# Altium schematic sheet Filter6.SchDoc
size 420 x 297 mm; SheetNumber: 11; SheetTotal: 13
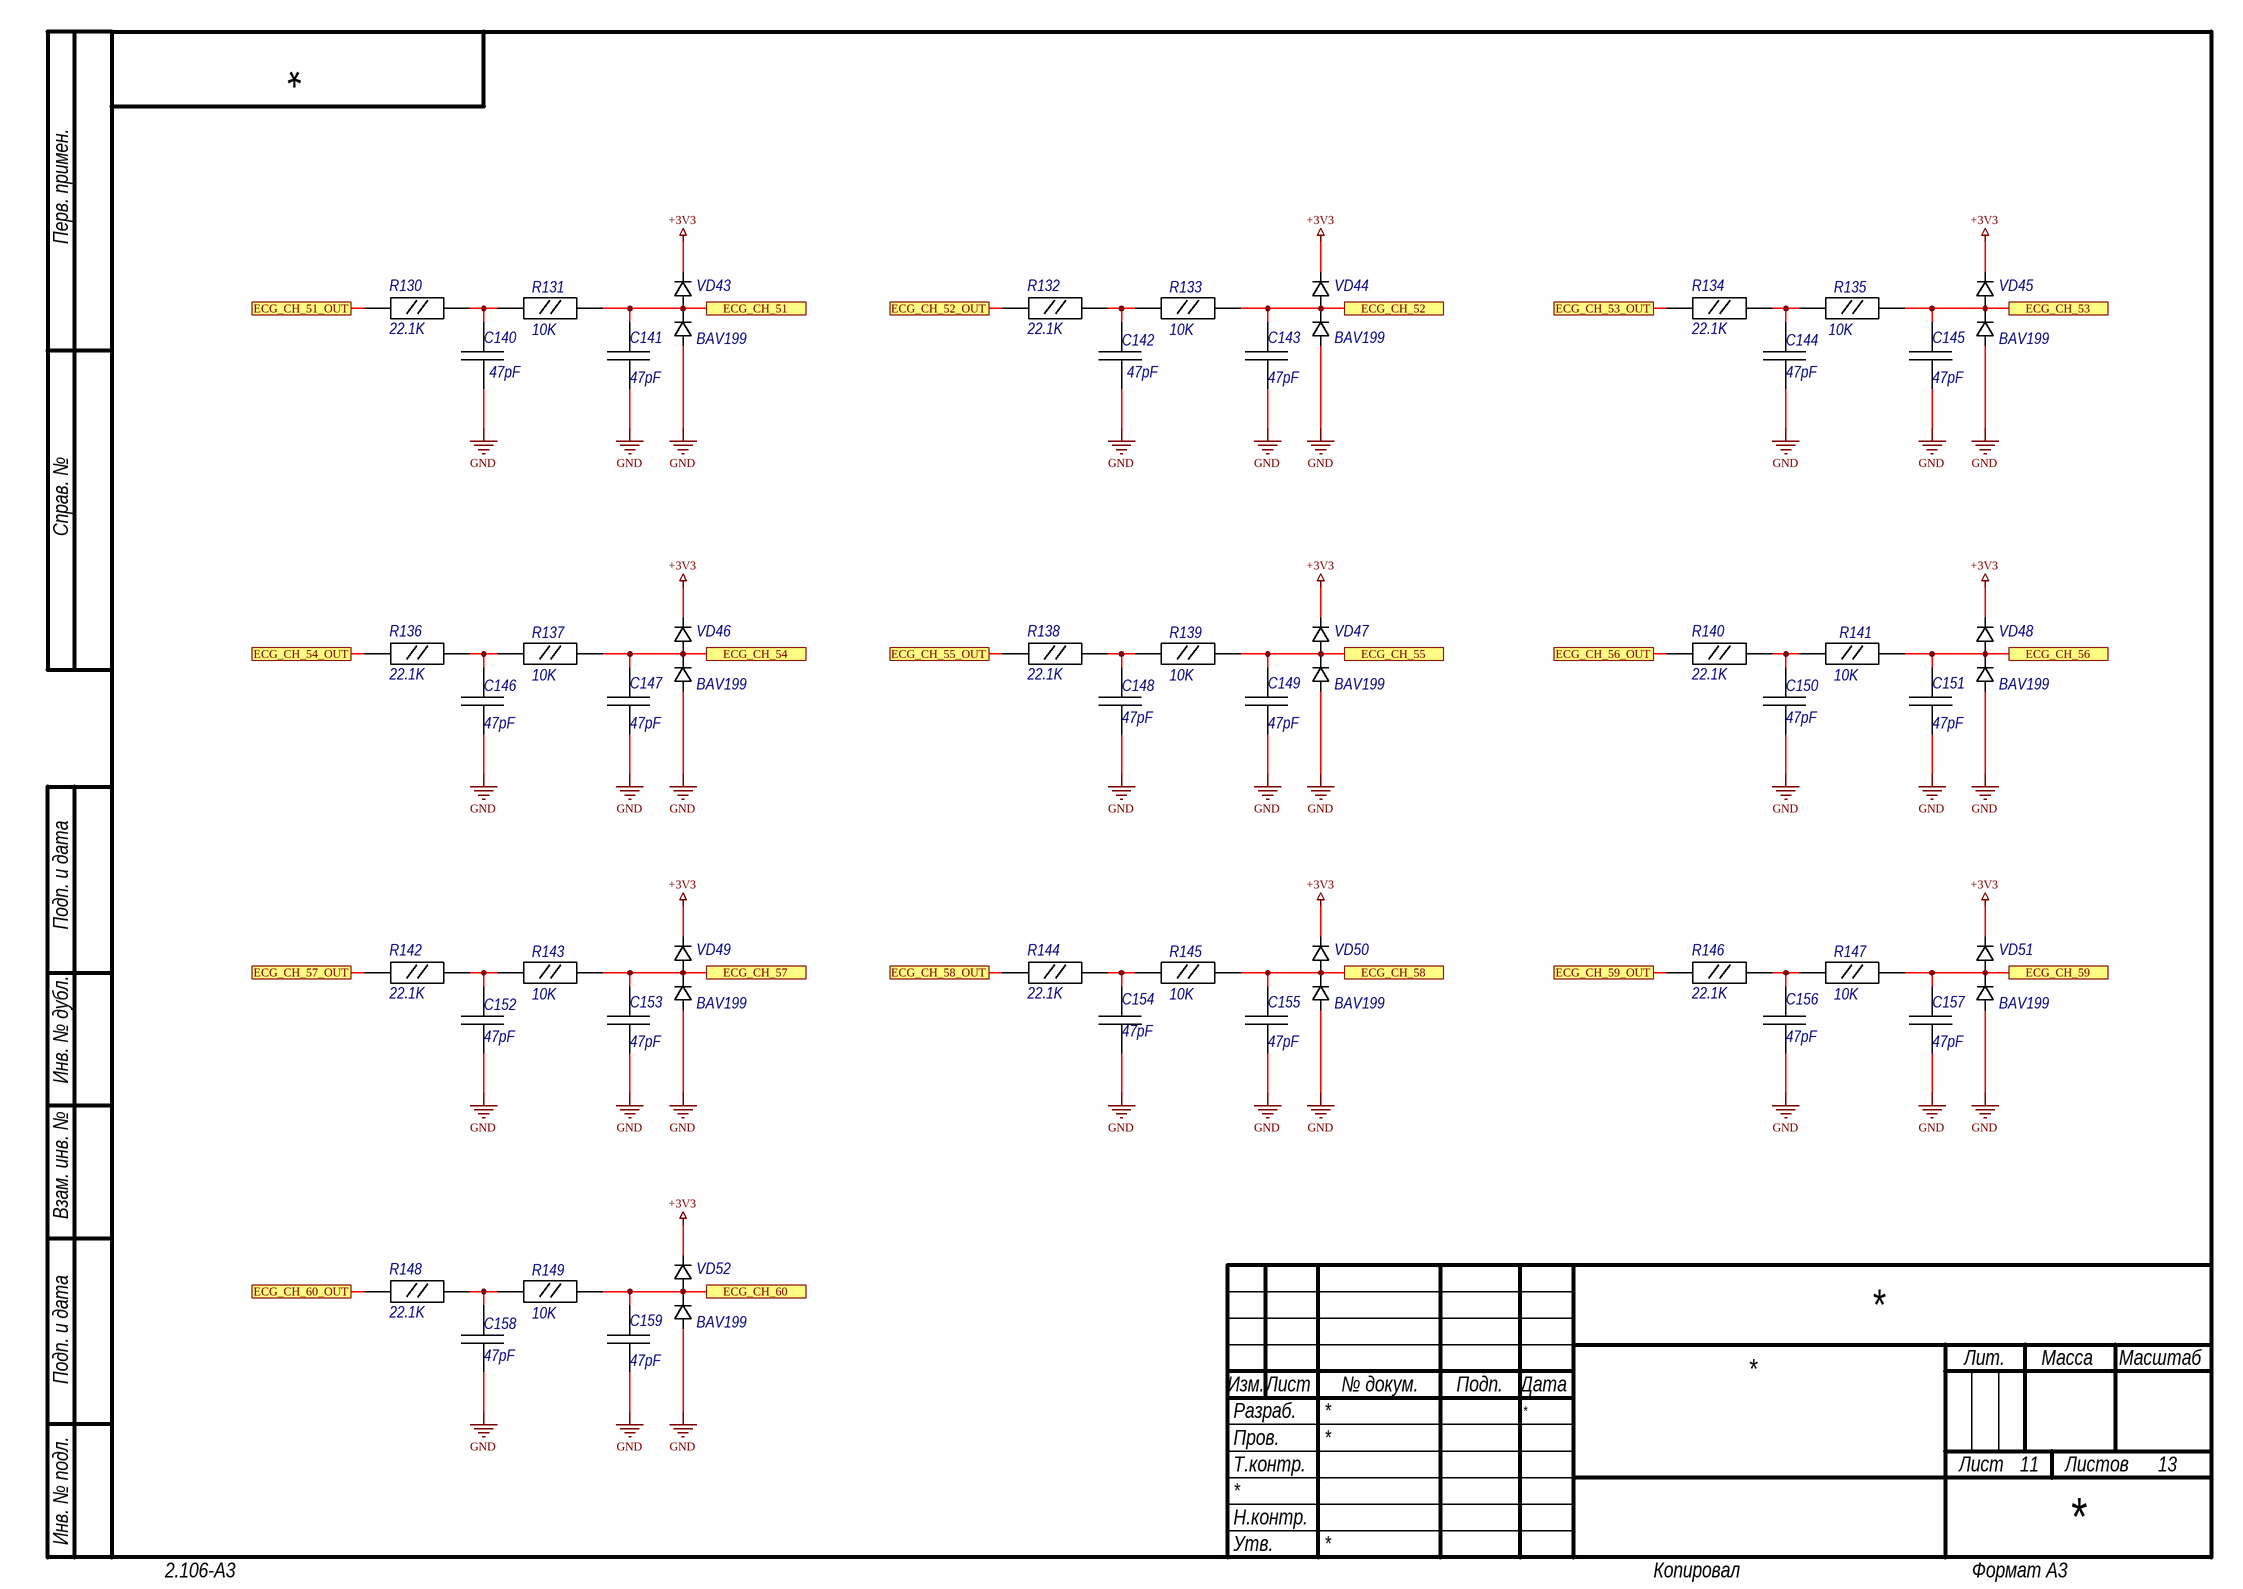
[diagram p0: Filter6.SchDoc]

## Parts
C140  47pF  [C0603]
C141  47pF  [C0603]
C142  47pF  [C0603]
C143  47pF  [C0603]
C144  47pF  [C0603]
C145  47pF  [C0603]
C146  47pF  [C0603]
C147  47pF  [C0603]
C148  47pF  [C0603]
C149  47pF  [C0603]
C150  47pF  [C0603]
C151  47pF  [C0603]
C152  47pF  [C0603]
C153  47pF  [C0603]
C154  47pF  [C0603]
C155  47pF  [C0603]
C156  47pF  [C0603]
C157  47pF  [C0603]
C158  47pF  [C0603]
C159  47pF  [C0603]
R130  22.1K  [R0603]
R131  10K  [R0603]
R132  22.1K  [R0603]
R133  10K  [R0603]
R134  22.1K  [R0603]
R135  10K  [R0603]
R136  22.1K  [R0603]
R137  10K  [R0603]
R138  22.1K  [R0603]
R139  10K  [R0603]
R140  22.1K  [R0603]
R141  10K  [R0603]
R142  22.1K  [R0603]
R143  10K  [R0603]
R144  22.1K  [R0603]
R145  10K  [R0603]
R146  22.1K  [R0603]
R147  10K  [R0603]
R148  22.1K  [R0603]
R149  10K  [R0603]
VD43  BAV199  [SOT23]
VD44  BAV199  [SOT23]
VD45  BAV199  [SOT23]
VD46  BAV199  [SOT23]
VD47  BAV199  [SOT23]
VD48  BAV199  [SOT23]
VD49  BAV199  [SOT23]
VD50  BAV199  [SOT23]
VD51  BAV199  [SOT23]
VD52  BAV199  [SOT23]

## Ports
ECG_CH_51, ECG_CH_51_OUT, ECG_CH_52, ECG_CH_52_OUT, ECG_CH_53, ECG_CH_53_OUT, ECG_CH_54, ECG_CH_54_OUT, ECG_CH_55, ECG_CH_55_OUT, ECG_CH_56, ECG_CH_56_OUT, ECG_CH_57, ECG_CH_57_OUT, ECG_CH_58, ECG_CH_58_OUT, ECG_CH_59, ECG_CH_59_OUT, ECG_CH_60, ECG_CH_60_OUT

## Nets
+3V3: VD43.2 VD44.2 VD45.2 VD46.2 VD47.2 VD48.2 VD49.2 VD50.2 VD51.2 VD52.2
GND: C140.1 C141.1 C142.1 C143.1 C144.1 C145.1 C146.1 C147.1 C148.1 C149.1 C150.1 C151.1 C152.1 C153.1 C154.1 C155.1 C156.1 C157.1 C158.1 C159.1 VD43.1 VD44.1 VD45.1 VD46.1 VD47.1 VD48.1 VD49.1 VD50.1 VD51.1 VD52.1
ECG_CH_51: C141.2 R131.2 VD43.3 ; port ECG_CH_51
ECG_CH_51_OUT: R130.1 ; port ECG_CH_51_OUT
ECG_CH_52: C143.2 R133.2 VD44.3 ; port ECG_CH_52
ECG_CH_52_OUT: R132.1 ; port ECG_CH_52_OUT
ECG_CH_53: C145.2 R135.2 VD45.3 ; port ECG_CH_53
ECG_CH_53_OUT: R134.1 ; port ECG_CH_53_OUT
ECG_CH_54: C147.2 R137.2 VD46.3 ; port ECG_CH_54
ECG_CH_54_OUT: R136.1 ; port ECG_CH_54_OUT
ECG_CH_55: C149.2 R139.2 VD47.3 ; port ECG_CH_55
ECG_CH_55_OUT: R138.1 ; port ECG_CH_55_OUT
ECG_CH_56: C151.2 R141.2 VD48.3 ; port ECG_CH_56
ECG_CH_56_OUT: R140.1 ; port ECG_CH_56_OUT
ECG_CH_57: C153.2 R143.2 VD49.3 ; port ECG_CH_57
ECG_CH_57_OUT: R142.1 ; port ECG_CH_57_OUT
ECG_CH_58: C155.2 R145.2 VD50.3 ; port ECG_CH_58
ECG_CH_58_OUT: R144.1 ; port ECG_CH_58_OUT
ECG_CH_59: C157.2 R147.2 VD51.3 ; port ECG_CH_59
ECG_CH_59_OUT: R146.1 ; port ECG_CH_59_OUT
ECG_CH_60: C159.2 R149.2 VD52.3 ; port ECG_CH_60
ECG_CH_60_OUT: R148.1 ; port ECG_CH_60_OUT
NetC140_2: C140.2 R130.2 R131.1
NetC142_2: C142.2 R132.2 R133.1
NetC144_2: C144.2 R134.2 R135.1
NetC146_2: C146.2 R136.2 R137.1
NetC148_2: C148.2 R138.2 R139.1
NetC150_2: C150.2 R140.2 R141.1
NetC152_2: C152.2 R142.2 R143.1
NetC154_2: C154.2 R144.2 R145.1
NetC156_2: C156.2 R146.2 R147.1
NetC158_2: C158.2 R148.2 R149.1

## Notes on the sheet
- Перв. примен.
- Справ. №
- Подп. и дата
- Инв. № дубл.
- Взам. инв. №
- Разраб.
- Изм.
- Лист
- № докум.
- Подп.
- Дата
- Лит.
- Масса
- Масштаб
- Пров.
- Т.контр.
- Листов
- Инв. № подл.
- Утв.
- Н.контр.
- 2.106-A3
- Копировал
- Формат А3

## Library data of the parts
C140-C159 = CC_SMD_0603: Ceramic Capacitor SMD; Package: 0603; Value: 47pF
R130-R149 = R0603: Resistor SMD
  R130 R132 R134 R136 R138 R140 R142 R144 R146 R148: Value: 22.1K
  R131 R133 R135 R137 R139 R141 R143 R145 R147 R149: Value: 10K
VD43-VD52 = DIODE_BAV199: Diod Schottky; Diode Type: Standard; Package: SOT-23; PartNumber: BAV199; Manufacturer Part Number 1: BAV199